# Altium schematic sheet Sensors.SchDoc
size A3
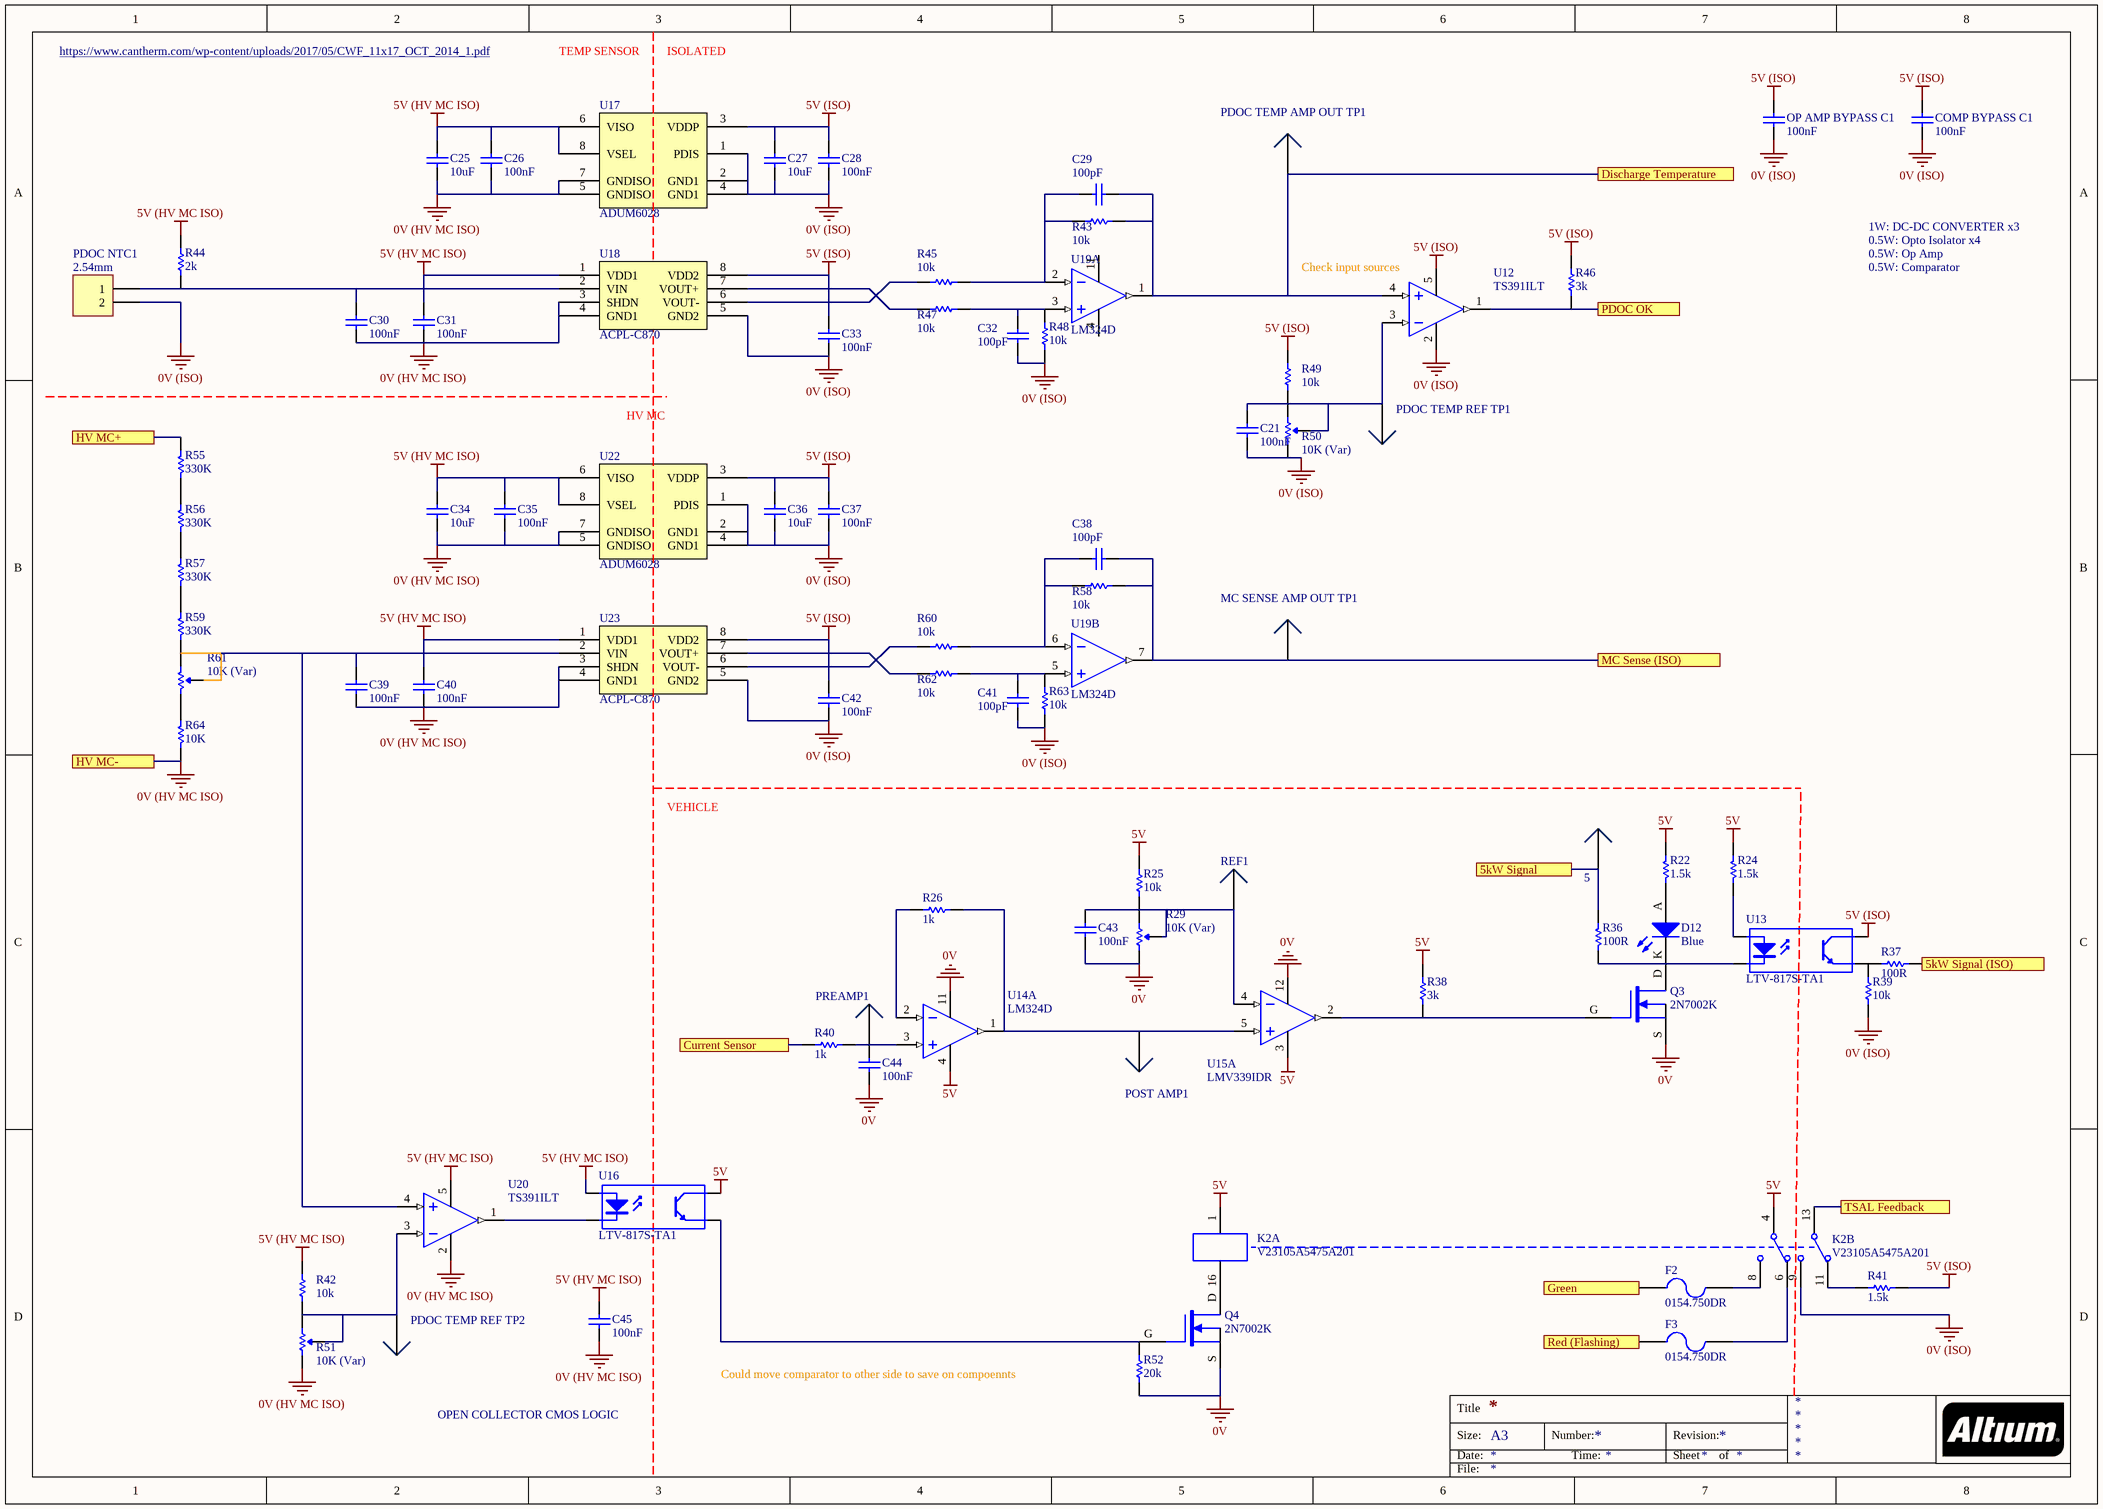
[diagram p0: Sensors.SchDoc]

## Parts
5  0mm  [TH Test Point]  (value not drawn)
C21  100nF  [0805]
C25  10uF  [0805]
C26  100nF  [0805]
C27  10uF  [0805]
C28  100nF  [0805]
C29  100pF  [0805]
C30  100nF  [0805]
C31  100nF  [0805]
C32  100pF  [0805]
C33  100nF  [0805]
C34  10uF  [0805]
C35  100nF  [0805]
C36  10uF  [0805]
C37  100nF  [0805]
C38  100pF  [0805]
C39  100nF  [0805]
C40  100nF  [0805]
C41  100pF  [0805]
C42  100nF  [0805]
C43  100nF  [0805]
C44  100nF  [0805]
C45  100nF  [0805]
COMP_BYPASS_C1  100nF  [0805]
D12  Blue  [0805 LED]
F2  0154.750DR  [Omni BLOK 0154]
F3  0154.750DR  [Omni BLOK 0154]
K2  V23105A5475A201  [TI 2-DIL]  (parts A,B of 2)
MC_SENSE_AMP_OUT_TP1  0mm  [SMD Test Point]  (value not drawn)
OP_AMP_BYPASS_C1  100nF  [0805]
PDOC_NTC1  2.54mm  [TH 2.54mm Header 1x2]
PDOC_TEMP_AMP_OUT_TP1  0mm  [SMD Test Point]  (value not drawn)
PDOC_TEMP_REF_TP1  0mm  [SMD Test Point]  (value not drawn)
PDOC_TEMP_REF_TP2  0mm  [SMD Test Point]  (value not drawn)
POST_AMP1  0mm  [TH Test Point]  (value not drawn)
PREAMP1  0mm  [TH Test Point]  (value not drawn)
Q3  2N7002K  [ON SOT-23 MOSFET]
Q4  2N7002K  [ON SOT-23 MOSFET]
R22  1.5k  [0805]
R24  1.5k  [0805]
R25  10k  [0805]
R26  1k  [0805]
R29  10K (Var)  [B 3296]
R36  100R  [0805]
R37  100R  [0805]
R38  3k  [0805]
R39  10k  [0805]
R40  1k  [0805]
R41  1.5k  [0805]
R42  10k  [0805]
R43  10k  [0805]
R44  2k  [0805]
R45  10k  [0805]
R46  3k  [0805]
R47  10k  [0805]
R48  10k  [0805]
R49  10k  [0805]
R50  10K (Var)  [B 3296]
R51  10K (Var)  [B 3296]
R52  20k  [0805]
R55  330K  [VB 0207]
R56  330K  [VB 0207]
R57  330K  [VB 0207]
R58  10k  [0805]
R59  330K  [VB 0207]
R60  10k  [0805]
R61  10K (Var)  [B 3296]
R62  10k  [0805]
R63  10k  [0805]
R64  10K  [VB 0207]
REF1  0mm  [TH Test Point]  (value not drawn)
U12  TS391ILT  [ON SOT-23-5]
U13  LTV-817S-TA1  [ON 4-SMD]
U14  LM324D  [TI 14-SOIC]  (part A of 4)
U15  LMV339IDR  [TI 14-SOIC]  (part A of 4)
U16  LTV-817S-TA1  [ON 4-SMD]
U17  ADUM6028  [AD 8-SOIC-W]
U18  ACPL-C870  [BROAD 8-SOIC]
U19  LM324D  [TI 14-SOIC]  (parts A,B of 4)
U20  TS391ILT  [ON SOT-23-5]
U22  ADUM6028  [AD 8-SOIC-W]
U23  ACPL-C870  [BROAD 8-SOIC]

## Ports
5kW Signal, 5kW Signal (ISO), Current Sensor, Discharge Temperature, Green, HV MC+, HV MC-, MC Sense (ISO), PDOC OK, Red (Flashing), TSAL Feedback

## Nets
0V: C43.1 C44.1 Q3.S Q4.S R29.3(CW) R52.1 U14.11(GND) U15.12(V-)
0V (HV MC ISO): C25.1 C26.1 C30.1 C31.1 C34.1 C35.1 C39.1 C40.1 C45.1 R51.3(CW) R64.1 U17.5(GNDISO) U17.7(GNDISO) U18.3(SHDN) U18.4(GND1) U20.2(VCC-) U22.5(GNDISO) U22.7(GNDISO) U23.3(SHDN) U23.4(GND1) ; port HV MC-
0V (ISO): C21.1 C27.1 C28.1 C32.1 C33.1 C36.1 C37.1 C41.1 C42.1 COMP_BYPASS_C1.1 K2.9 OP_AMP_BYPASS_C1.1 PDOC_NTC1.2 R39.1 R48.1 R50.3(CW) R63.1 U12.2(VCC-) U17.1(PDIS) U17.2(GND1) U17.4(GND1) U18.5(GND2) U22.1(PDIS) U22.2(GND1) U22.4(GND1) U23.5(GND2)
5V: K2.1 K2.4 R22.2 R24.2 R25.2 R38.2 U14.4(VCC) U15.3(V+) U16.4(C)
5V (HV MC ISO): C25.2 C26.2 C31.2 C34.2 C35.2 C40.2 C45.2 R42.2 R44.2 U16.1(A) U17.6(VISO) U17.8(VSEL) U18.1(VDD1) U20.5(VCC+) U22.6(VISO) U22.8(VSEL) U23.1(VDD1)
5V (ISO): C27.2 C28.2 C33.2 C36.2 C37.2 C42.2 COMP_BYPASS_C1.2 OP_AMP_BYPASS_C1.2 R41.2 R46.2 R49.2 U12.5(VCC+) U13.4(C) U17.3(VDDP) U18.8(VDD2) U22.3(VDDP) U23.8(VDD2)
5kW Signal: 5.1 R36.2 ; port 5kW Signal
5kW Signal (ISO): R37.2 ; port 5kW Signal (ISO)
Current Sensor: R40.1 ; port Current Sensor
Discharge Temperature: C29.2 PDOC_TEMP_AMP_OUT_TP1.1 R43.2 U12.4(IIN+) U19.1(1OUT) ; port Discharge Temperature
Green: F2.1 ; port Green
HV MC+: R55.2 ; port HV MC+
MC Sense (ISO): C38.2 MC_SENSE_AMP_OUT_TP1.1 R58.2 U19.7(2OUT) ; port MC Sense (ISO)
PDOC OK: R46.1 U12.1(OUT) ; port PDOC OK
Red (Flashing): F3.1 ; port Red (Flashing)
TSAL Feedback: K2.13 ; port TSAL Feedback
NetC21_2: C21.2 PDOC_TEMP_REF_TP1.1 R49.1 R50.1(CCW) R50.2(Wiper) U12.3(IN-)
NetC29_1: C29.1 R43.1 R45.2 U19.2(1IN+)
NetC30_2: C30.2 PDOC_NTC1.1 R44.1 U18.2(VIN)
NetC32_2: C32.2 R47.2 R48.2 U19.3(1IN+)
NetC38_1: C38.1 R58.1 R60.2 U19.6(2IN-)
NetC39_2: C39.2 R59.1 R61.2(Wiper) R61.3(CW) U20.4(IIN+) U23.2(VIN)
NetC41_2: C41.2 R62.2 R63.2 U19.5(2IN+)
NetC43_2: C43.2 R25.1 R29.1(CCW) R29.2(Wiper) REF1.1 U15.4(IN_A-)
NetC44_2: C44.2 PREAMP1.1 R40.2 U14.3(1IN+)
NetD12_A: D12.A R22.1
NetD12_K: D12.K Q3.D R36.1 U13.2(K)
NetF2_2: F2.2 K2.8
NetF3_2: F3.2 K2.6
NetK2_11: K2.11 R41.1
NetK2_16: K2.16 Q4.D
NetPDOC_TEMP_REF_TP2_1: PDOC_TEMP_REF_TP2.1 R42.1 R51.1(CCW) R51.2(Wiper) U20.3(IN-)
NetPOST_AMP1_1: POST_AMP1.1 R26.2 U14.1(1OUT) U15.5(IN_A+)
NetQ3_G: Q3.G R38.1 U15.2(OUT_A)
NetQ4_G: Q4.G R52.2 U16.3(E)
NetR24_1: R24.1 U13.1(A)
NetR26_1: R26.1 U14.2(1IN+)
NetR37_1: R37.1 R39.2 U13.3(E)
NetR45_1: R45.1 U18.6(VOUT-)
NetR47_1: R47.1 U18.7(VOUT+)
NetR55_1: R55.1 R56.2
NetR56_1: R56.1 R57.2
NetR57_1: R57.1 R59.2
NetR60_1: R60.1 U23.6(VOUT-)
NetR61_1: R61.1(CCW) R64.2
NetR62_1: R62.1 U23.7(VOUT+)
NetU16_2: U16.2(K) U20.1(OUT)

Not connected (* = marked no-connect by the designer): U19 4(VCC) 11(GND)

## Notes on the sheet
- https://www.cantherm.com/wp-content/uploads/2017/05/CWF_11x17_OCT_2014_1.pdf
- TEMP SENSOR
- ISOLATED
- 1W: DC-DC CONVERTER x3
- 0.5W: Opto Isolator x4
- (near U12) Check input sources
- 0.5W: Op Amp
- 0.5W: Comparator
- HV MC
- VEHICLE
- Could move comparator to other side to save on compoennts
- OPEN COLLECTOR CMOS LOGIC
- Title
- Size:
- Date:
- A3
- Number:
- Time:
- Revision:
- Sheet
- of
- File:

## Library data of the parts
5 POST_AMP1 PREAMP1 REF1 = TH Test Point: Positions: 1; Angle: 0; Flange: No; Contact: NA; Part Number: TH Test Point; Pitch: 0mm; Row Spacing: 0mm
C21 C26 C28 C30 C31 C33 C35 C37 C39 C40 C42-C45 = GCM21BR71E104KA37L: Manufacturer: muRata; Tolerance: 10%; Material: X7R; Rated Voltage: 25V; Part Number: GCM21BR71E104KA37L; Value: 100nF
C25 C27 C34 C36 = GRM21BR6YA106KE43L: Manufacturer: muRata; Tolerance: 10%; Material: X5R; Rated Voltage: 50V; Part Number: GRM21BR6YA106KE43L; Value: 10uF; Digikey Part Number: 490-10514-6-ND
C29 C32 C38 C41 = GCM21B5C1H101JA37L: Manufacturer: muRata; Tolerance: 5%; Material: C0G; Rated Voltage: 50V; Part Number: GCM21B5C1H101JA37L; Value: 100pF
COMP_BYPASS_C1 OP_AMP_BYPASS_C1 = GCM21BR71E104KA37L: Manufacturer: muRata; Tolerance: 10%; Rated Voltage: 25V; Part Number: GCM21BR71E104KA37L; Value: 100nF; Material: X7R
D12 = SML-MN2BCTT86C: LED BLUE CLEAR 2012 SMD; Manufacturer: ROHM Semiconductor; Part Number: SML-MN2BCTT86C; Colour: Blue; Digikey Part Number: 846-1207-1-ND; Digikey Link: https://www.digikey.com/product-detail/en/rohm-semiconductor/SMLMN2BCTT86C/846-1207-1-ND/6057239
F2 F3 = 0154.750DR: FUSE BOARD MNT 750MA 125VAC/VDC; Manufacturer: LittelFuse Inc; Part Number: 0154.750DR; Digikey Part Number: F1221CT-ND; Digikey Link: https://www.digikey.com/product-detail/en/littelfuse-inc/0154.750DR/F1221CT-ND/183370
K2 = V23105A5475A201: 5V DPDT Relay 3A 220VDC; Manufacturer: Axicom; Part Number: V23105A5475A201; Digikey Part Number: PB383-ND; Digikey Link: https://www.digikey.com/products/en?mpart=V23105A5001A201&v=41
MC_SENSE_AMP_OUT_TP1 PDOC_TEMP_AMP_OUT_TP1 PDOC_TEMP_REF_TP1 PDOC_TEMP_REF_TP2 = SMD Test Point: Positions: 1; Row Spacing: 0; Flange: No; Contact: NA; Part Number: SMD Test Point; Pitch: 0mm; Angle: 0
PDOC_NTC1 = TH 2.54mm Header 1x2: Positions: 2; Angle: 0; Flange: No; Contact: NA; Part Number: TH 2.54mm Header 1x2; Pitch: 2.54mm; Row Spacing: 2.54mm
Q3 Q4 = 2N7002K: 60V 380mA, NFET MOSTFET (Small Signal); Manufacturer: ON Semiconductor; Published: 24-Mar-1999; LatestRevisionDate: 29-May-2009; LatestRevisionNote: IPC-7351 Footprint Added.; PackageVersion: Sep-2000; PackageReference: SOT-343; Publisher: Altium Limited; PackageDescription: 4-Pin SOT-343 Package 1.3 mm Pitch, 2.1 mm Lead Span; Part Number: 2N7002K; Digikey Part Number: 2N7002KCT-ND; Digikey Link: https://www.digikey.com/product-detail/en/on-semiconductor/2N7002K/2N7002KCT-ND/2060375; Qty: 30
R22 R24 R41 = RC0805FR071K5L: Manufacturer: YAGEO; Tolerance: 0.01; Rated Voltage: 0.125W; Part Number: RC0805FR071K5L; Value: 1.5k; Material: FR-07
R25 R39 R42 R43 R45 R47-R49 R58 R60 R62 R63 = RC0805FR0710KL: Manufacturer: YAGEO; Tolerance: 0.01; Rated Voltage: 0.125W; Part Number: RC0805FR0710KL; Value: 10k; Material: FR-07
R26 R40 = RC0805FR071KL: Manufacturer: YAGEO; Tolerance: 0.01; Rated Voltage: 0.125W; Part Number: RC0805FR071KL; Value: 1k; Material: FR-07
R29 R50 R51 R61 = 3296W-1-103LF: Manufacturer: Bournes Inc; Tolerance: 0.1; Rated Voltage: 0.5W; Part Number: 3296W-1-103LF; Value: 10K (Var); Digikey Part Number: 3296W-103LF-ND
R36 R37 = RC0805FR07100RL: Manufacturer: YAGEO; Tolerance: 0.01; Rated Voltage: 0.125W; Part Number: RC0805FR07100RL; Value: 100R; Material: FR-07
R38 R46 = RC0805FR073KL: Manufacturer: YAGEO; Tolerance: 0.01; Rated Voltage: 0.125W; Part Number: RC0805FR073KL; Value: 3k; Material: FR-07
R44 = RC0805FR072KL: Manufacturer: YAGEO; Tolerance: 0.01; Rated Voltage: 0.125W; Part Number: RC0805FR072KL; Value: 2k; Material: FR-07
R52 = RC0805FR0720KL: Manufacturer: YAGEO; Tolerance: 0.01; Rated Voltage: 0.125W; Part Number: RC0805FR0720KL; Value: 20k; Material: FR-07
R55-R57 R59 = MMB02070C3303FB200: Manufacturer: Vishay Beyschlag; Tolerance: 0.01; Rated Voltage: 1W; Part Number: MMB02070C3303FB200; Value: 330K; Digikey Part Number: MMB-330KBCT-ND
R64 = MMB02070C1002FB200: Manufacturer: Vishay Beyschlag; Tolerance: 0.01; Rated Voltage: 1W; Part Number: MMB02070C1002FB200; Value: 10K; Digikey Part Number: MMB-10KBCT-ND
U12 U20 = TS391ILT: IC COMP LO PWR SGL V SOT 23-5L; Manufacturer: STMicroelectronics; Part Number: TS391ILT; Digikey Part Number: 497-2275-2-ND; Digikey Link: https://www.digikey.com/product-detail/en/stmicroelectronics/TS391ILT/497-2275-2-ND/599407
U13 U16 = LTV-817S-TA1: 35V 50ma Optocoupler (VF=1.2V); Manufacturer: Lite-On Inc; Part Number: LTV-817S-TA1; Digikey Part Number: 160-1893-2-ND; Digikey Link: https://www.digikey.com/product-detail/en/lite-on-inc/LTV-817S-TA1/160-1893-2-ND/388451
U14 U19 = LM324D: IC OPAMP GP 4 CIRCUIT 14SOIC; Manufacturer: Texas Instruments; Part Number: LM324D; Digikey Part Number: 296-1390-5-ND; Digikey Link: https://www.digikey.com/product-detail/en/texas-instruments/LM324D/296-1390-5-ND/277039
U15 = LMV339IDR: Comparator General Purpose Open Collector 14-SOIC; Manufacturer: Texas Instruments; Part Number: LMV339IDR; Digikey Part Number: 296-6611-2-ND; Digikey Link: https://www.digikey.com/product-detail/en/texas-instruments/LMV339MTX-NOPB/296-35446-1-ND/3739150
U17 U22 = ADUM6028: Isolated Module DC DC Converter 1 Output 3.3V, 5V 60mA 4.5V - 5.5V Input; Manufacturer: Analog Devices; Output Voltage: 5V, 3.3V; Output Power: 2W; Efficiency: 0.33; Part Number: ADUM6028; Input Voltage: 4.5V-5.5V; Isolation: Isolated; Digikey Part Number: ADUM6028-5BRIZ-ND; Digikey Link: https://www.digikey.com/product-detail/en/analog-devices-inc/ADUM6028-5BRIZ/ADUM6028-5BRIZ-ND/9485494
U18 U23 = ACPL-C870: Isolation Amplifier 1 Circuit Differential 8-SO; Manufacturer: Broadcom Limited; Part Number: ACPL-C870; Digikey Part Number: 516-2578-5-ND; Digikey Link: https://www.digikey.com/product-detail/en/broadcom-limited/ACPL-C870-000E/516-2578-5-ND/3523705